# Altium project EvoHD_Lite.PrjPcb
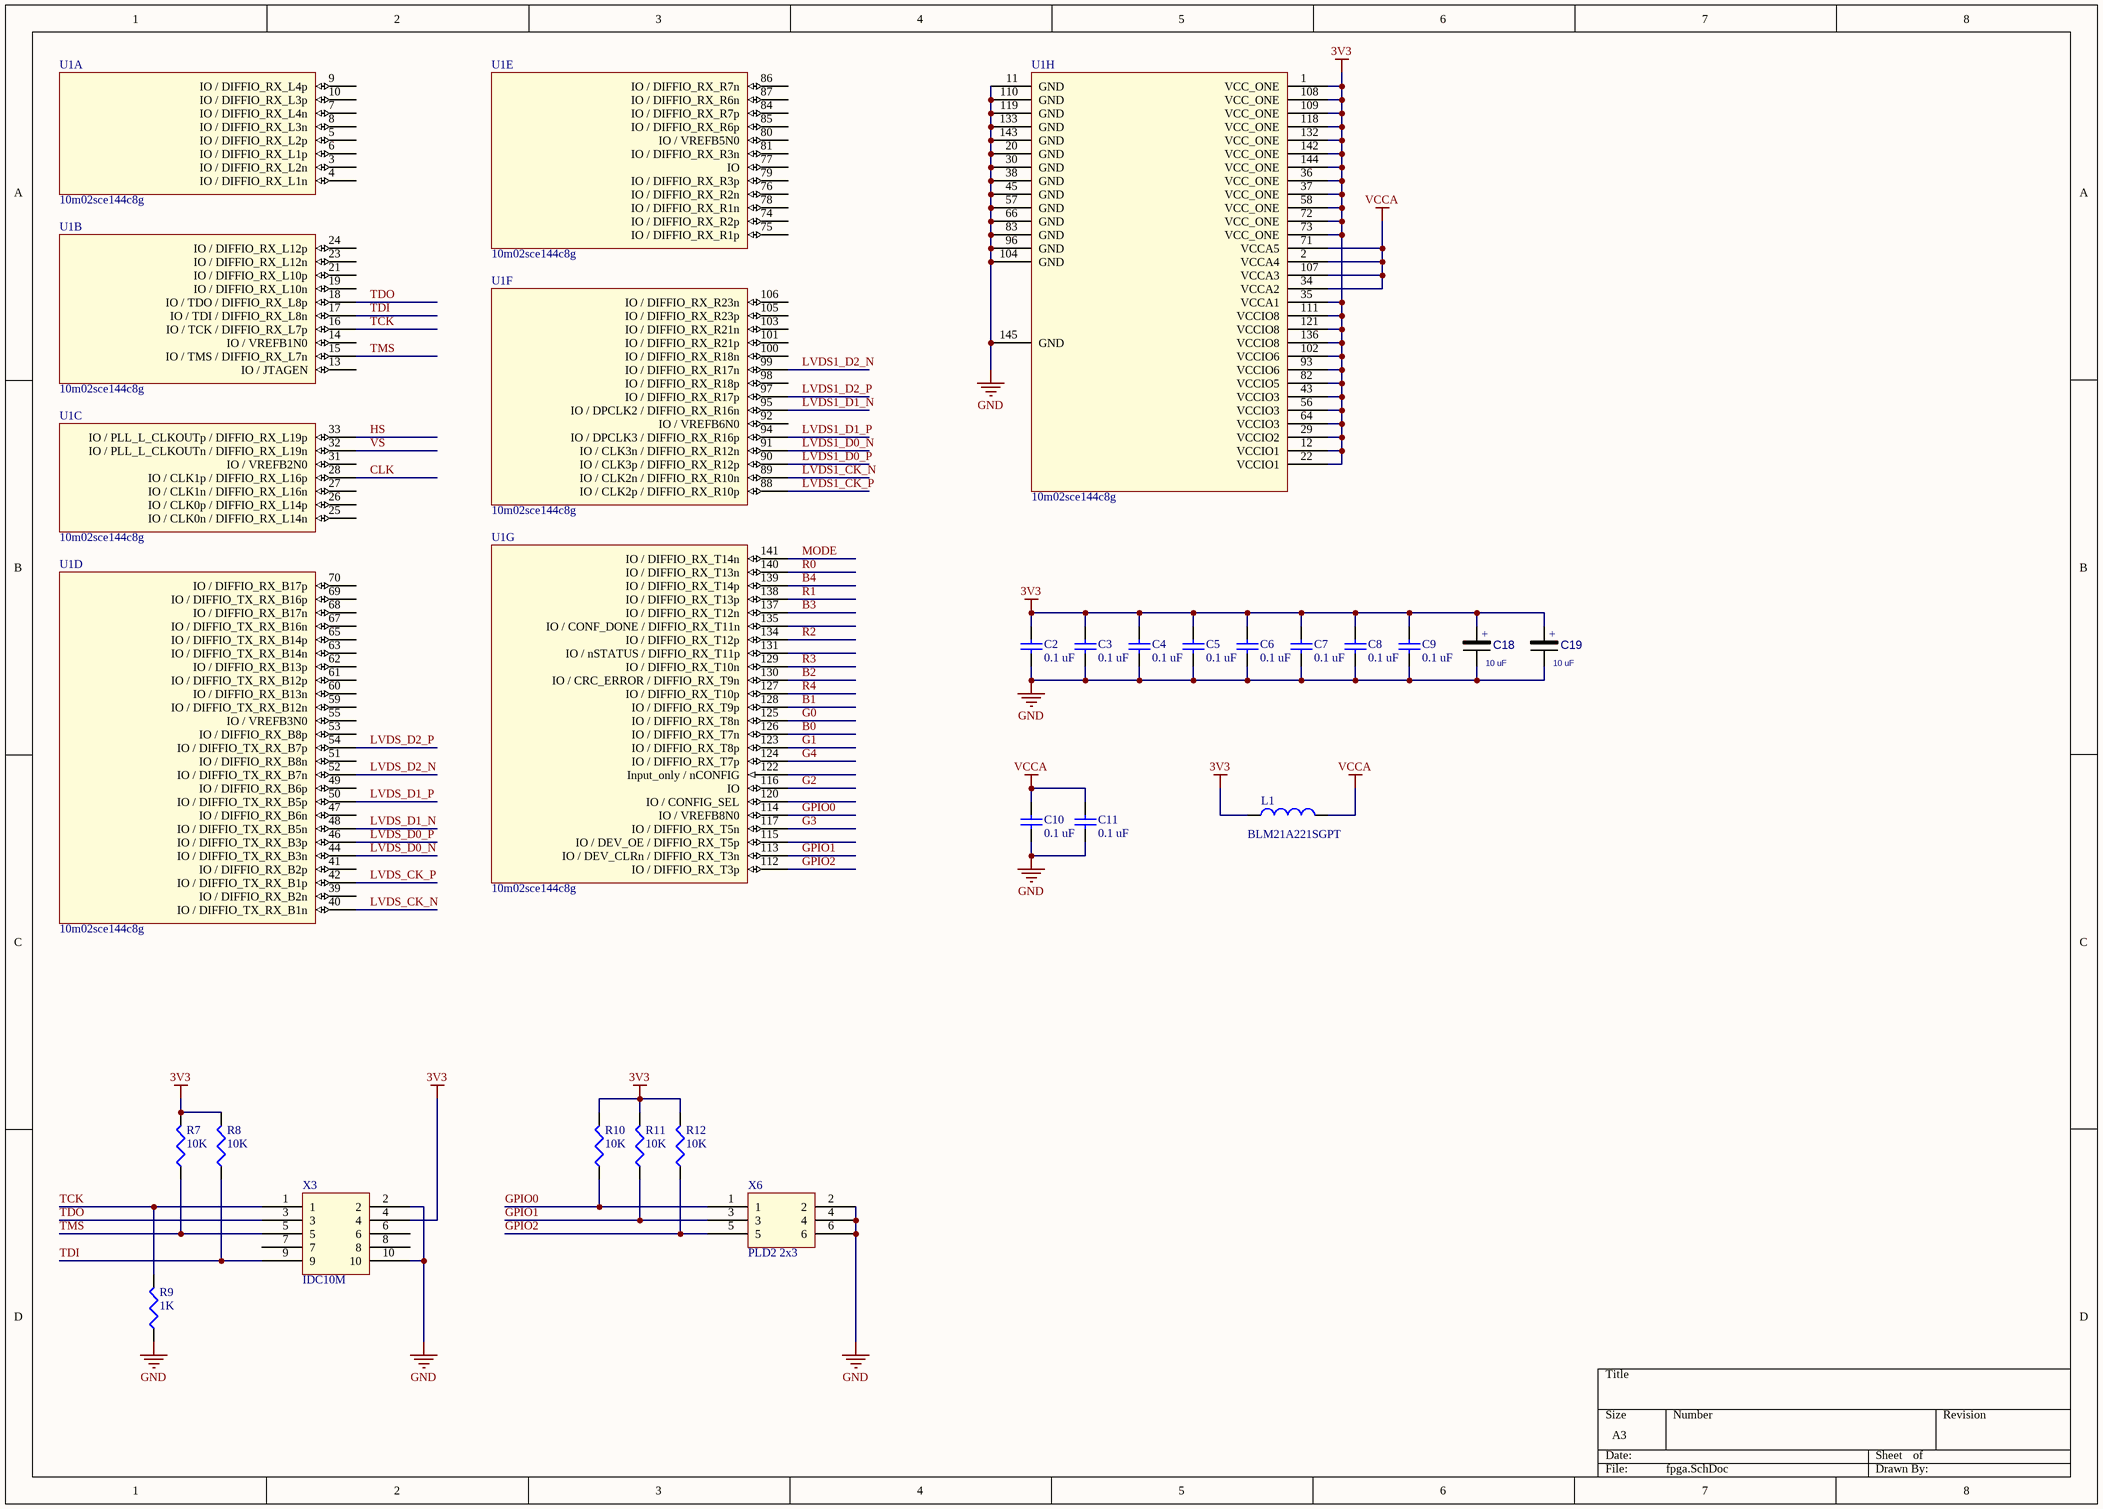
[diagram p0: fpga.SchDoc]
4 sheets, 43 parts. Net scope: global (net labels, ports and power ports of the same name join across sheets).
Board file: EvoHD_Lite_RevA.PcbDoc
Sheets:
  fpga.SchDoc
  bus.SchDoc
  power.SchDoc
  hdmi.SchDoc

## Sheet fpga.SchDoc
size A3

### Parts
C2  0.1 uF  [0805 chip cap]
C3  0.1 uF  [0805 chip cap]
C4  0.1 uF  [0805 chip cap]
C5  0.1 uF  [0805 chip cap]
C6  0.1 uF  [0805 chip cap]
C7  0.1 uF  [0805 chip cap]
C8  0.1 uF  [0805 chip cap]
C9  0.1 uF  [0805 chip cap]
C10  0.1 uF  [0805 chip cap]
C11  0.1 uF  [0805 chip cap]
C18  10 uF  [CAP CASE-A]
C19  10 uF  [CAP CASE-A]
L1  BLM21A221SGPT  [0805 CHIP RES]
R7  10K  [0805 CHIP RES]
R8  10K  [0805 CHIP RES]
R9  1K  [0805 CHIP RES]
R10  10K  [0805 CHIP RES]
R11  10K  [0805 CHIP RES]
R12  10K  [0805 CHIP RES]
U1  10m02sce144c8g  [Altera TQFP 50P 22X22 145N]  (parts A,B,C,D,E,F,G,H of 8)
X3  IDC10M  [PLD2-10]
X6  PLD2 2x3  [PLD2-6]

### Nets
3V3: C2.2 C3.2 C4.2 C5.2 C6.2 C7.2 C8.2 C9.2 C18.1 C19.1 L1.1 R7.2 R8.2 R10.2 R11.2 R12.2 U1.1(VCC_ONE) U1.12(VCCIO1) U1.22(VCCIO1) U1.29(VCCIO2) U1.35(VCCA1) U1.36(VCC_ONE) U1.37(VCC_ONE) U1.43(VCCIO3) U1.56(VCCIO3) U1.58(VCC_ONE) U1.64(VCCIO3) U1.72(VCC_ONE) U1.73(VCC_ONE) U1.82(VCCIO5) U1.93(VCCIO6) U1.102(VCCIO6) U1.108(VCC_ONE) U1.109(VCC_ONE) U1.111(VCCIO8) U1.118(VCC_ONE) U1.121(VCCIO8) U1.132(VCC_ONE) U1.136(VCCIO8) U1.142(VCC_ONE) U1.144(VCC_ONE) X3.4
GND: C2.1 C3.1 C4.1 C5.1 C6.1 C7.1 C8.1 C9.1 C10.1 C11.1 C18.2 C19.2 R9.1 U1.11(GND) U1.20(GND) U1.30(GND) U1.38(GND) U1.45(GND) U1.57(GND) U1.66(GND) U1.83(GND) U1.96(GND) U1.104(GND) U1.110(GND) U1.119(GND) U1.133(GND) U1.143(GND) U1.145(GND) X3.2 X3.10 X6.2 X6.4 X6.6
VCCA: C10.2 C11.2 L1.2 U1.2(VCCA4) U1.34(VCCA2) U1.71(VCCA5) U1.107(VCCA3)
B0: U1.126(IO_/_DIFFIO_RX_T7n)
B1: U1.128(IO_/_DIFFIO_RX_T9p)
B2: U1.130(IO_/_CRC_ERROR_/_DIFFIO_RX_T9n)
B3: U1.137(IO_/_DIFFIO_RX_T12n)
B4: U1.139(IO_/_DIFFIO_RX_T14p)
CLK: U1.28(IO_/_CLK1p_/_DIFFIO_RX_L16p)
G0: U1.125(IO_/_DIFFIO_RX_T8n)
G1: U1.123(IO_/_DIFFIO_RX_T8p)
G2: U1.116(IO)
G3: U1.117(IO_/_DIFFIO_RX_T5n)
G4: U1.124(IO_/_DIFFIO_RX_T7p)
GPIO0: R10.1 U1.114(IO_/_VREFB8N0) X6.1
GPIO1: R11.1 U1.113(IO_/_DEV_CLRn_/_DIFFIO_RX_T3n) X6.3
GPIO2: R12.1 U1.112(IO_/_DIFFIO_RX_T3p) X6.5
HS: U1.33(IO_/_PLL_L_CLKOUTp_/_DIFFIO_RX_L19p)
LVDS1_CK_N: U1.89(IO_/_CLK2n_/_DIFFIO_RX_R10n)
LVDS1_CK_P: U1.88(IO_/_CLK2p_/_DIFFIO_RX_R10p)
LVDS1_D0_N: U1.91(IO_/_CLK3n_/_DIFFIO_RX_R12n)
LVDS1_D0_P: U1.90(IO_/_CLK3p_/_DIFFIO_RX_R12p)
LVDS1_D1_N: U1.95(IO_/_DPCLK2_/_DIFFIO_RX_R16n)
LVDS1_D1_P: U1.94(IO_/_DPCLK3_/_DIFFIO_RX_R16p)
LVDS1_D2_N: U1.99(IO_/_DIFFIO_RX_R17n)
LVDS1_D2_P: U1.97(IO_/_DIFFIO_RX_R17p)
LVDS_CK_N: U1.40(IO_/_DIFFIO_TX_RX_B1n)
LVDS_CK_P: U1.42(IO_/_DIFFIO_TX_RX_B1p)
LVDS_D0_N: U1.44(IO_/_DIFFIO_TX_RX_B3n)
LVDS_D0_P: U1.46(IO_/_DIFFIO_TX_RX_B3p)
LVDS_D1_N: U1.48(IO_/_DIFFIO_TX_RX_B5n)
LVDS_D1_P: U1.50(IO_/_DIFFIO_TX_RX_B5p)
LVDS_D2_N: U1.52(IO_/_DIFFIO_TX_RX_B7n)
LVDS_D2_P: U1.54(IO_/_DIFFIO_TX_RX_B7p)
MODE: U1.141(IO_/_DIFFIO_RX_T14n)
R0: U1.140(IO_/_DIFFIO_RX_T13n)
R1: U1.138(IO_/_DIFFIO_RX_T13p)
R2: U1.134(IO_/_DIFFIO_RX_T12p)
R3: U1.129(IO_/_DIFFIO_RX_T10n)
R4: U1.127(IO_/_DIFFIO_RX_T10p)
TCK: R9.2 U1.16(IO_/_TCK_/_DIFFIO_RX_L7p) X3.1
TDI: R8.1 U1.17(IO_/_TDI_/_DIFFIO_RX_L8n) X3.9
TDO: U1.18(IO_/_TDO_/_DIFFIO_RX_L8p) X3.3
TMS: R7.1 U1.15(IO_/_TMS_/_DIFFIO_RX_L7n) X3.5
VS: U1.32(IO_/_PLL_L_CLKOUTn_/_DIFFIO_RX_L19n)

Not connected (* = marked no-connect by the designer): U1 3(IO_/_DIFFIO_RX_L2n) 4(IO_/_DIFFIO_RX_L1n) 5(IO_/_DIFFIO_RX_L2p) 6(IO_/_DIFFIO_RX_L1p) 7(IO_/_DIFFIO_RX_L4n) 8(IO_/_DIFFIO_RX_L3n) 9(IO_/_DIFFIO_RX_L4p) 10(IO_/_DIFFIO_RX_L3p) 13(IO_/_JTAGEN) 14(IO_/_VREFB1N0) 19(IO_/_DIFFIO_RX_L10n) 21(IO_/_DIFFIO_RX_L10p) 23(IO_/_DIFFIO_RX_L12n) 24(IO_/_DIFFIO_RX_L12p) 25(IO_/_CLK0n_/_DIFFIO_RX_L14n) 26(IO_/_CLK0p_/_DIFFIO_RX_L14p) 27(IO_/_CLK1n_/_DIFFIO_RX_L16n) 31(IO_/_VREFB2N0) 39(IO_/_DIFFIO_RX_B2n) 41(IO_/_DIFFIO_RX_B2p) 47(IO_/_DIFFIO_RX_B6n) 49(IO_/_DIFFIO_RX_B6p) 51(IO_/_DIFFIO_RX_B8n) 53(IO_/_DIFFIO_RX_B8p) 55(IO_/_VREFB3N0) 59(IO_/_DIFFIO_TX_RX_B12n) 60(IO_/_DIFFIO_RX_B13n) 61(IO_/_DIFFIO_TX_RX_B12p) 62(IO_/_DIFFIO_RX_B13p) 63(IO_/_DIFFIO_TX_RX_B14n) 65(IO_/_DIFFIO_TX_RX_B14p) 67(IO_/_DIFFIO_TX_RX_B16n) 68(IO_/_DIFFIO_RX_B17n) 69(IO_/_DIFFIO_TX_RX_B16p) 70(IO_/_DIFFIO_RX_B17p) 74(IO_/_DIFFIO_RX_R2p) 75(IO_/_DIFFIO_RX_R1p) 76(IO_/_DIFFIO_RX_R2n) 77(IO) 78(IO_/_DIFFIO_RX_R1n) 79(IO_/_DIFFIO_RX_R3p) 80(IO_/_VREFB5N0) 81(IO_/_DIFFIO_RX_R3n) 84(IO_/_DIFFIO_RX_R7p) 85(IO_/_DIFFIO_RX_R6p) 86(IO_/_DIFFIO_RX_R7n) 87(IO_/_DIFFIO_RX_R6n) 92(IO_/_VREFB6N0) 98(IO_/_DIFFIO_RX_R18p) 100(IO_/_DIFFIO_RX_R18n) 101(IO_/_DIFFIO_RX_R21p) 103(IO_/_DIFFIO_RX_R21n) 105(IO_/_DIFFIO_RX_R23p) 106(IO_/_DIFFIO_RX_R23n) 115(IO_/_DEV_OE_/_DIFFIO_RX_T5p) 120(IO_/_CONFIG_SEL) 122(Input_only_/_nCONFIG) 131(IO_/_nSTATUS_/_DIFFIO_RX_T11p) 135(IO_/_CONF_DONE_/_DIFFIO_RX_T11n); X3 6 7 8

### Notes on the sheet
- (in symbol CAP POL CASE A) +

### Library data of the parts
C2-C11 = Cap: Capacitor; Value: 0.1 uF
C18 C19 = CAP POL CASE A: Value: 10 uF
L1 = BLM21A221SGPT: CHIP FERRITE BEADS 220R AT 100Mhz; Value: 220R at 100Mhz
R7-R12 = CHIP RES: Resistor
  R7 R8 R10-R12: Value: 10K
  R9: Value: 1K
U1 = 10m02sce144c8g: FPGA MAX10
X3 = PLD2-10
X6 = PLD2-6

## Sheet bus.SchDoc
size A4
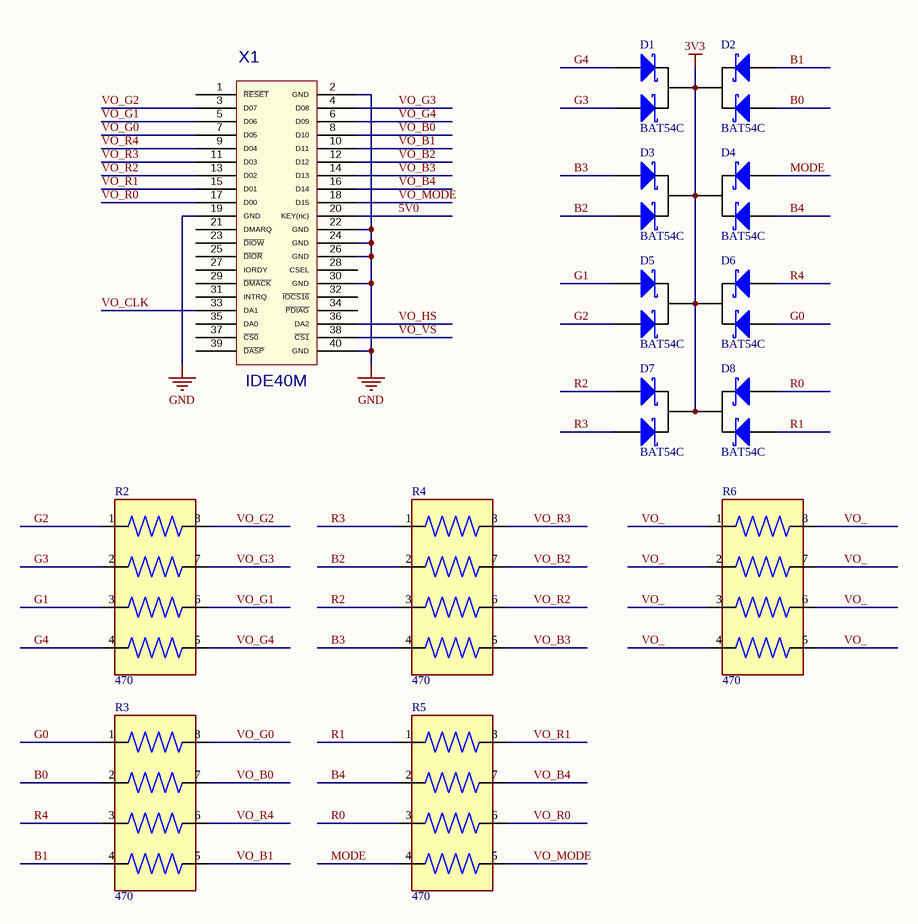
[diagram p1: bus.SchDoc]

### Parts
D1  BAT54C  [SOT-23]
D2  BAT54C  [SOT-23]
D3  BAT54C  [SOT-23]
D4  BAT54C  [SOT-23]
D5  BAT54C  [SOT-23]
D6  BAT54C  [SOT-23]
D7  BAT54C  [SOT-23]
D8  BAT54C  [SOT-23]
R2  470  [RESCAV50P200X100X55-8N]
R3  470  [RESCAV50P200X100X55-8N]
R4  470  [RESCAV50P200X100X55-8N]
R5  470  [RESCAV50P200X100X55-8N]
R6  470  [RESCAV50P200X100X55-8N]
X1  IDE40M  [IDE40M]

### Nets
3V3: D1.3(C) D2.3(C) D3.3(C) D4.3(C) D5.3(C) D6.3(C) D7.3(C) D8.3(C)
5V0: X1.20(KEY(nc))
GND: X1.2(GND) X1.19(GND) X1.22(GND) X1.24(GND) X1.26(GND) X1.30(GND) X1.40(GND)
B0: D2.2(A) R3.2
B1: D2.1(A) R3.4
B2: D3.2(A) R4.2
B3: D3.1(A) R4.4
B4: D4.2(A) R5.2
G0: D6.2(A) R3.1
G1: D5.1(A) R2.3
G2: D5.2(A) R2.1
G3: D1.2(A) R2.2
G4: D1.1(A) R2.4
MODE: D4.1(A) R5.4
R0: D8.1(A) R5.3
R1: D8.2(A) R5.1
R2: D7.1(A) R4.3
R3: D7.2(A) R4.1
R4: D6.1(A) R3.3
VO_: R6.1 R6.2 R6.3 R6.4 R6.5 R6.6 R6.7 R6.8
VO_B0: R3.7 X1.8(D10)
VO_B1: R3.5 X1.10(D11)
VO_B2: R4.7 X1.12(D12)
VO_B3: R4.5 X1.14(D13)
VO_B4: R5.7 X1.16(D14)
VO_CLK: X1.33(DA1)
VO_G0: R3.8 X1.7(D05)
VO_G1: R2.6 X1.5(D06)
VO_G2: R2.8 X1.3(D07)
VO_G3: R2.7 X1.4(D08)
VO_G4: R2.5 X1.6(D09)
VO_HS: X1.36(DA2)
VO_MODE: R5.5 X1.18(D15)
VO_R0: R5.6 X1.17(D00)
VO_R1: R5.8 X1.15(D01)
VO_R2: R4.6 X1.13(D02)
VO_R3: R4.8 X1.11(D03)
VO_R4: R3.6 X1.9(D04)
VO_VS: X1.38(~{CS1})

Not connected (* = marked no-connect by the designer): X1 1(~{RESET}) 21(DMARQ) 23(~{DIOW}) 25(~{DIOR}) 27(IORDY) 28(CSEL) 29(~{DMACK}) 31(INTRQ) 32(~{IOCS16}) 34(~{PDIAG}) 35(DA0) 37(~{CS0}) 39(~{DASP})

### Library data of the parts
R2-R6 = CAT10-***4LF: *** Ohm Â±5% 62.5mW Power Per Element Isolated Resistor Network/Array Â±250ppm/Â°C 0804, Concave, Long Side Terminals; MP: CAT10-101J4LF; Package: None; Price: None; Value: 470; Availability: Unavailable
X1 = IDE40M: Value: *

## Sheet power.SchDoc
size A4
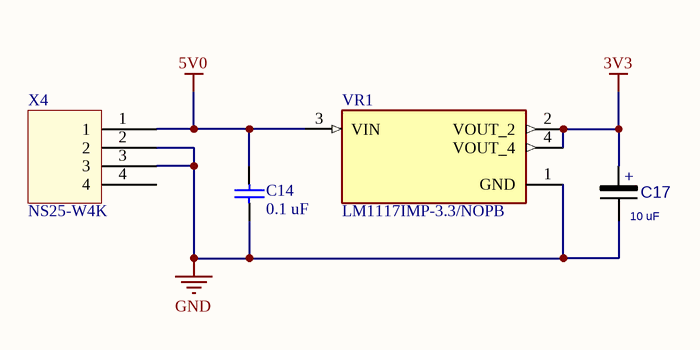
[diagram p2: power.SchDoc]

### Parts
C14  0.1 uF  [0805 chip cap]
C17  10 uF  [CAP CASE-A]
VR1  LM1117IMP-3.3/NOPB  [VREG_LM1117IMP-3.3/NOPB]
X4  NS25-W4K  [NS25-W4K]

### Nets
3V3: C17.1 VR1.2(VOUT_2) VR1.4(VOUT_4)
5V0: C14.2 VR1.3(VIN) X4.1
GND: C14.1 C17.2 VR1.1(GND) X4.2 X4.3

Not connected (* = marked no-connect by the designer): X4 4

### Notes on the sheet
- (in symbol CAP POL CASE A) +

### Library data of the parts
C14 = Cap: Capacitor; Value: 0.1 uF
C17 = CAP POL CASE A: Value: 10 uF
VR1 = LM1117IMP-3.3/NOPB: 800-mA 15-V linear voltage regulator 4-SOT-223 0 to 125; Price: None; Package: None; Availability: Unavailable; MP: LM1117IMP-3.3/NOPB; Value: *

## Sheet hdmi.SchDoc
size A4
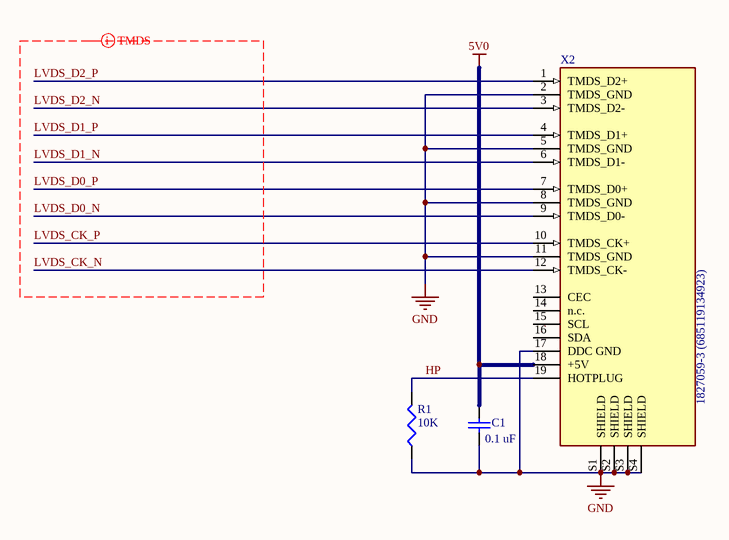
[diagram p3: hdmi.SchDoc]

### Parts
C1  0.1 uF  [0805 chip cap]
R1  10K  [0805 CHIP RES]
X2  1827059-3 (685119134923)  [1827059-3 (685119134923)]

### Nets
5V0: C1.2 X2.18(+5V)
GND: C1.1 R1.1 X2.2(TMDS_GND) X2.5(TMDS_GND) X2.8(TMDS_GND) X2.11(TMDS_GND) X2.17(DDC_GND) X2.S1(SHIELD) X2.S2(SHIELD) X2.S3(SHIELD) X2.S4(SHIELD)
HP: R1.2 X2.19(HOTPLUG)
LVDS_CK_N: X2.12(TMDS_CK-)
LVDS_CK_P: X2.10(TMDS_CK+)
LVDS_D0_N: X2.9(TMDS_D0-)
LVDS_D0_P: X2.7(TMDS_D0+)
LVDS_D1_N: X2.6(TMDS_D1-)
LVDS_D1_P: X2.4(TMDS_D1+)
LVDS_D2_N: X2.3(TMDS_D2-)
LVDS_D2_P: X2.1(TMDS_D2+)

Not connected (* = marked no-connect by the designer): X2 13(CEC) 14(n.c.) 15(SCL) 16(SDA)

### Layout directives
differential pair; differential pair class TDMS_DIFF; net class TDMS: LVDS_CK_N, LVDS_CK_P, LVDS_D0_N, LVDS_D0_P, LVDS_D1_N, LVDS_D1_P, LVDS_D2_N, LVDS_D2_P

### Library data of the parts
C1 = Cap: Capacitor; Value: 0.1 uF
R1 = CHIP RES: Resistor; Value: 10K
X2 = 1827059-3 (685119134923): HDMI Connector | Right Angle | Without Flange | -20C to 85C / 1827059-3 / KLS1-285-1-N-1-R / 1747981-1 / 685119134923; MP: SS-53000-001; MF: Stewart Connector; Price: None; SnapEDA_Link: https://www.snapeda.com/parts/SS-53000-001/Stewart%20Connector/view-part/4628816/?ref=snap; Availability: Unavailable; Value: *; Package: None

## Nets that join several sheets
3V3: fpga (42 pins), bus (8 pins), power (C17.1 VR1.2 VR1.4)
5V0: bus (X1.20), power (C14.2 VR1.3 X4.1), hdmi (C1.2 X2.18)
GND: fpga (33 pins), bus (7 pins), power (5 pins), hdmi (11 pins)
B0: fpga (U1.126), bus (D2.2 R3.2)
B1: fpga (U1.128), bus (D2.1 R3.4)
B2: fpga (U1.130), bus (D3.2 R4.2)
B3: fpga (U1.137), bus (D3.1 R4.4)
B4: fpga (U1.139), bus (D4.2 R5.2)
G0: fpga (U1.125), bus (D6.2 R3.1)
G1: fpga (U1.123), bus (D5.1 R2.3)
G2: fpga (U1.116), bus (D5.2 R2.1)
G3: fpga (U1.117), bus (D1.2 R2.2)
G4: fpga (U1.124), bus (D1.1 R2.4)
LVDS_CK_N: fpga (U1.40), hdmi (X2.12)
LVDS_CK_P: fpga (U1.42), hdmi (X2.10)
LVDS_D0_N: fpga (U1.44), hdmi (X2.9)
LVDS_D0_P: fpga (U1.46), hdmi (X2.7)
LVDS_D1_N: fpga (U1.48), hdmi (X2.6)
LVDS_D1_P: fpga (U1.50), hdmi (X2.4)
LVDS_D2_N: fpga (U1.52), hdmi (X2.3)
LVDS_D2_P: fpga (U1.54), hdmi (X2.1)
MODE: fpga (U1.141), bus (D4.1 R5.4)
R0: fpga (U1.140), bus (D8.1 R5.3)
R1: fpga (U1.138), bus (D8.2 R5.1)
R2: fpga (U1.134), bus (D7.1 R4.3)
R3: fpga (U1.129), bus (D7.2 R4.1)
R4: fpga (U1.127), bus (D6.1 R3.3)